# Altium schematic sheet Templates.SCHDOC
size B
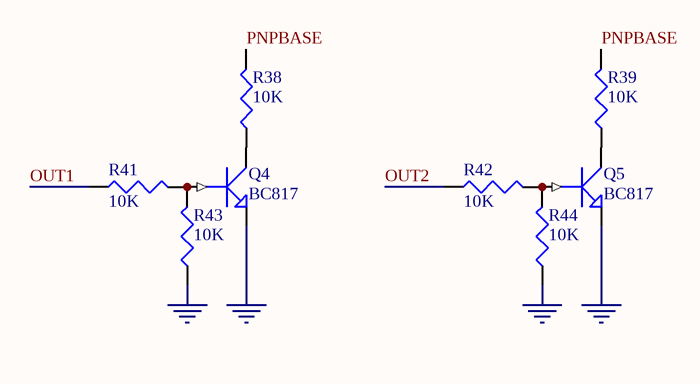
[diagram p0: Templates.SCHDOC]

## Parts
Q4  BC817  [SOT-23]
Q5  BC817  [SOT-23]
R38  10K  [0805]
R39  10K  [0805]
R41  10K  [0603]
R42  10K  [0805]
R43  10K  [0805]
R44  10K  [0805]

## Nets
GND: Q4.3(E) Q5.3(E) R43.1 R44.1
OUT1: R41.1
OUT2: R42.1
PNPBASE: R38.2 R39.2
NetQ4_1: Q4.1(B) R41.2 R43.2
NetQ4_2: Q4.2(C) R38.1
NetQ5_1: Q5.1(B) R42.2 R44.2
NetQ5_2: Q5.2(C) R39.1

## Library data of the parts
Q4 Q5 = NPN1: NPN Transistor
R38 R39 R41-R44 = RES1